# Altium schematic sheet DASH_SWITCHES.SchDoc
size A
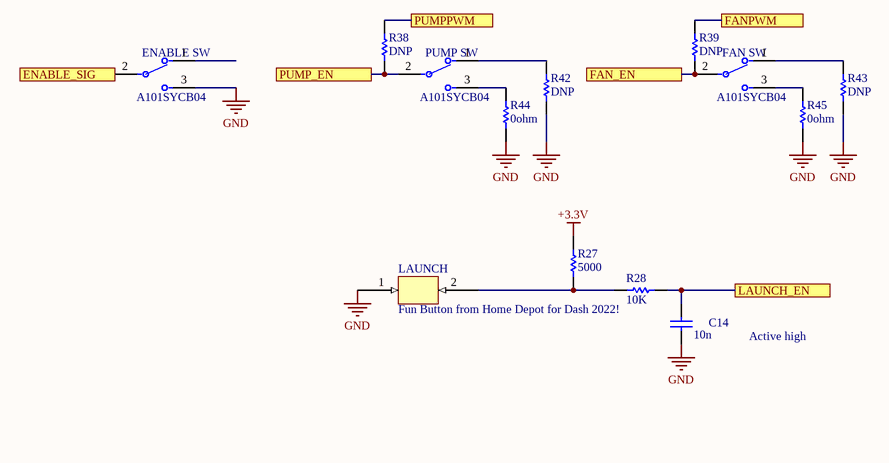
[diagram p0: DASH_SWITCHES.SchDoc]

## Parts
C14  10n  [CAPC1608X90X35ML10T15]
ENABLE_SW  A101SYCB04  [FP-A101SYCB04-MFG]
FAN_SW  A101SYCB04  [FP-A101SYCB04-MFG]
LAUNCH  Fun Button from Home Depot for Dash 2022!  [New footprint 1]
PUMP_SW  A101SYCB04  [FP-A101SYCB04-MFG]
R27  5000  [RESC1608X55X25ML10T15]
R28  10K  [RESC1608X55X25ML10T15]
R38  DNP  [RESC1608X55X25ML10T15]
R39  DNP  [RESC1608X55X25ML10T15]
R42  DNP  [RESC1608X55X25ML10T15]
R43  DNP  [RESC1608X55X25ML10T15]
R44  0ohm  [RESC1608X55X25ML10T15]
R45  0ohm  [RESC1608X55X25ML10T15]

## Ports
ENABLE_SIG, FAN_EN, FANPWM, LAUNCH_EN, PUMP_EN, PUMPPWM

## Nets
+3.3V: R27.2
GND: C14.1 ENABLE_SW.3 LAUNCH.1 R42.1 R43.1 R44.1 R45.1
ENABLE_SIG: ENABLE_SW.2 ; port ENABLE_SIG
FAN_EN: FAN_SW.2 R39.1 ; port FAN_EN
FANPWM: R39.2 ; port FANPWM
LAUNCH_EN: C14.2 R28.2 ; port LAUNCH_EN
PUMP_EN: PUMP_SW.2 R38.1 ; port PUMP_EN
PUMPPWM: R38.2 ; port PUMPPWM
NetFAN_SW_1: FAN_SW.1 R43.2
NetFAN_SW_3: FAN_SW.3 R45.2
NetLAUNCH_2: LAUNCH.2 R27.1 R28.1
NetPUMP_SW_1: PUMP_SW.1 R42.2
NetPUMP_SW_3: PUMP_SW.3 R44.2

Not connected (* = marked no-connect by the designer): ENABLE_SW 1

## Notes on the sheet
- Active high

## Library data of the parts
C14 = CMP-2100-03642-1: Chip Capacitor, 10 nF, +/- 10%, 50 V, -55 to 125 degC, 0603 (1608 Metric), RoHS, Tape and Reel; Manufacturer: Murata; Insulation Resistance: 10GR; Dielectric: X7R; Voltage Rating: 50V; Capacitance: 10nF; Material: Ceramic; Package Quantity: 1; Lead Free: LeadFree; Case/Package: 0603; Termination: SMD/SMT; REACH SVHC: Unknown; Manufacturer URL: http://www.murata.com/; Datasheet URL: http://search.murata.co.jp/Ceramy/image/img/A01X/G101/ENG/GRM188R71H103KA01-01.pdf; Mount: SurfaceMount; Datasheet Version: 42401.0; Number of Pins: 2; Length: 1.6mm; Voltage: 50V; Depth: 0.8mm; Tolerance: 10%; Min Operating Temperature: -55degC; Voltage Rating (DC): 50V; Max Operating Temperature: 125degC; Package Description: 2-Pin Surface Mount Device, Body 1.6 x 0.8 mm; RoHSCompliant: True; Case Code (Imperial): 0603; Width: 0.031inch; Case Code (Metric): 1608; Height: 0.8mm; Package Reference: 0603; Packaging: TapeandReel; Thickness: 0.035inch; Dielectric Material: Ceramic
ENABLE_SW FAN_SW PUMP_SW = CMP-03408-000017-1: SWITCH TOGGLE SPDT 0.4VA 20V; Electrical Life: 6000Cycles; Number of Poles: 1; Power Rating: 400mW; Switch Function: On-On; Contact Resistance: 10mR; Contact Current Rating: 400mA; Actuator Material: Phenolic; Insulation Resistance: 30MR; Actuator Color: Chrome; Number of Positions: 2; Actuator Type: Standard Round; Actuator Length: 10.41mm; Illumination Type: Non-Illuminated; Flammability Rating: UL94 V-1; Contact Material: Copper; Depth: 6.86mm; Contact Plating: Gold; Voltage Rating (AC): 20V; Max Voltage Rating (DC): 20V; Min Operating Temperature: -30°C; Max Operating Temperature: 85°C; Throw Configuration: SPDT; Packaging: Bulk; Termination: PC Pins; Series: Gemini A; ELV: Compliant; Lead Free: Lead Free; RoHS Compliant: Yes; REACH SVHC: No SVHC; Mount: Panel; Orientation: Straight; Package Quantity: 100; Max Voltage Rating (AC): 20V; Radiation Hardening: No; Voltage Rating (DC): 20V
LAUNCH = HOME-DEPOT-BUTTON-DASH-2022-1: This is the very fun and very interesting button from Home Depot to be used for the IFE Dashboard 2022
R27 R28 = CMP-009-000010-1: Chip Resistor, 0 Ohm, 0.1 W, -55 to 155 degC, 0603 (1608 Metric); Source: Integrated_Library - 12.03.21 - 15.39.SchLib; Design Item ID: CMP-009-00006-4
R38 R39 R42 R44 = CMP-009-000010-1: Can be used to set dual set constant speed of pump with no PWM / Chip Resistor, 0 Ohm, 0.1 W, -55 to 155 degC, 0603 (1608 Metric); Source: Integrated_Library - 12.03.21 - 15.39.SchLib; Design Item ID: CMP-009-00006-4
R43 R45 = CMP-009-000010-1: Can be used to set dual set constant speed of fans with no PWM / Chip Resistor, 0 Ohm, 0.1 W, -55 to 155 degC, 0603 (1608 Metric); Source: Integrated_Library - 12.03.21 - 15.39.SchLib; Design Item ID: CMP-009-00006-4